# Altium schematic sheet Sheet1.SchDoc
size A; SheetNumber: 1; SheetTotal: 1
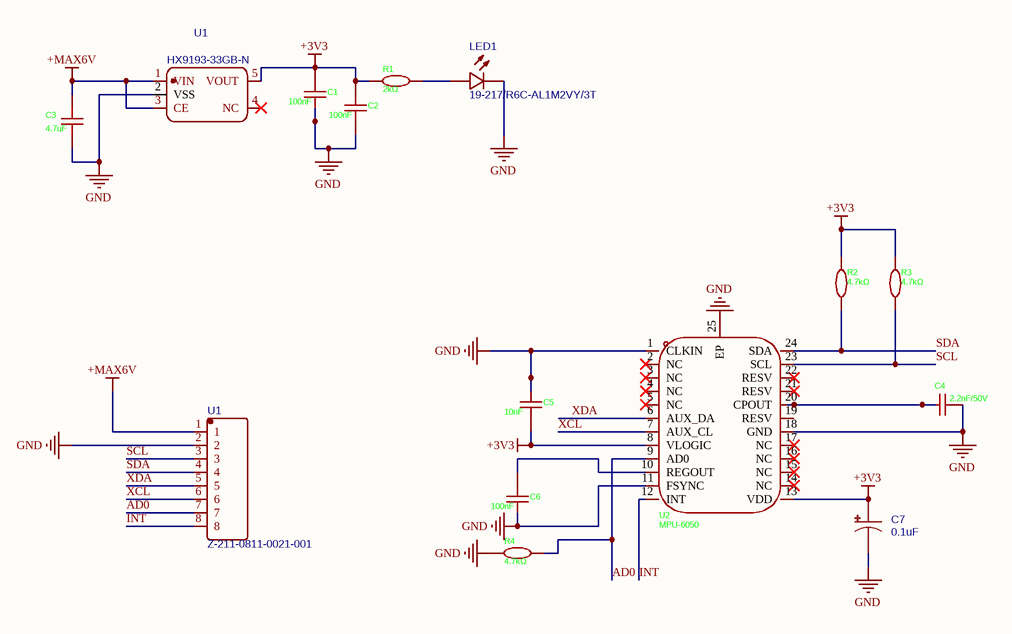
[diagram p0: Sheet1.SchDoc]

## Parts
(Parts that share a designator on the sheet are numbered #1, #2 ... from top to bottom, then left to right.)
C1  100nF  [C0603]
C2  100nF  [C0603]
C3  4.7uF  [C0603]
C4  value 2.2nF/50V  [C0805]
C5  10nF  [C0603]
C6  100nF  [C0603]
C7  0.1uF  [CAP-SMD_L3.2-W1.6]
LED1  19-217/R6C-AL1M2VY/3T  [LED0603-RD]
R1  2kΩ  [R0603]
R2  4.7kΩ  [R0603]
R3  4.7kΩ  [R0603]
R4  4.7kΩ  [R0603]
U1#1  HX9193-33GB-N  [SOT-23-5_L2.9-W1.6-P0.95-LS2.8-BL]
U1#2  Z-211-0811-0021-001  [HDR-TH_8P-P2.54-V-M]
U2  MPU-6050  [QFN-24_L4.0-W4.0-P0.50-BL-EP2.7]

## Nets
+3V3: C1.2 C2.2 C5.1 C7.1 R1.1 R2.2 R3.2 U1#1.5(VOUT) U2.8(VLOGIC) U2.13(VDD)
+MAX6V: C3.2 U1#1.1(VIN) U1#1.3(CE) U1#2.1
GND: C1.1 C2.1 C3.1 C4.2 C5.2 C6.1 C7.2 LED1.1(C) R4.2 U1#1.2(VSS) U1#2.2 U2.1(CLKIN) U2.11(FSYNC) U2.18(GND) U2.25(EP)
AD0: R4.1 U1#2.7 U2.9(AD0)
INT: U1#2.8 U2.12(INT)
SCL: R3.1 U1#2.3 U2.23(SCL)
SDA: R2.1 U1#2.4 U2.24(SDA)
XCL: U1#2.6 U2.7(AUX_CL)
XDA: U1#2.5 U2.6(AUX_DA)
NetC4_1: C4.1 U2.20(CPOUT)
NetC6_2: C6.2 U2.10(REGOUT)
NetLED1_2: LED1.2(A) R1.2

Not connected (* = marked no-connect by the designer): U1#1 4(NC)*; U2 2(NC)* 3(NC)* 4(NC)* 5(NC)* 14(NC)* 15(NC)* 16(NC)* 17(NC)* 19(RESV) 21(RESV)* 22(RESV)*

## Library data of the parts
C1 C2 C6 = CC0603KRX7R9BB104: Manufacturer: YAGEO(国巨); Add into BOM: yes; Tolerance: ±10%; Symbol: CC0603KRX7R9BB104; Device: CC0603KRX7R9BB104; LCSC Part Name: 100nF ±10% 50V; Supplier Part: C14663; Manufacturer Part: CC0603KRX7R9BB104; Supplier Footprint: 0603; JLCPCB Part Class: Basic Part; Datasheet: https://atta.szlcsc.com/upload/public/pdf/source/20180910/C282072_33301C7F631E79921B82A8DAC6BCC5B3.pdf; Supplier: LCSC; Convert to PCB: yes; Value: 100nF
C3 = CL10A475KO8NNNC: Manufacturer: SAMSUNG(三星); Add into BOM: yes; Tolerance: ±10%; Symbol: CL10A475KO8NNNC; Device: CL10A475KO8NNNC; LCSC Part Name: 4.7uF ±10% 16V; Supplier Part: C19666; Manufacturer Part: CL10A475KO8NNNC; Supplier Footprint: 0603; JLCPCB Part Class: Basic Part; Datasheet: https://atta.szlcsc.com/upload/public/pdf/source/20160218/1457707763339.pdf; Supplier: LCSC; Convert to PCB: yes; Value: 4.7uF
C4 = CL21C222JBFNNNE: Manufacturer: SAMSUNG(三星); Add into BOM: yes; Tolerance: ±5%; Symbol: CL21C222JBFNNNE; Device: CL21C222JBFNNNE; LCSC Part Name: 2.2nF ±5% 50V; Supplier Part: C28260; Manufacturer Part: CL21C222JBFNNNE; Supplier Footprint: 0805; JLCPCB Part Class: Basic Part; Datasheet: https://atta.szlcsc.com/upload/public/pdf/source/20160218/1457707763339.pdf; Supplier: LCSC; Convert to PCB: yes
C5 = CC0603KRX7R9BB104: Manufacturer: YAGEO(国巨); Add into BOM: yes; Value: 100nF; Tolerance: ±10%; Symbol: CC0603KRX7R9BB104; Device: CC0603KRX7R9BB104; LCSC Part Name: 100nF ±10% 50V; Supplier Part: C14663; Manufacturer Part: CC0603KRX7R9BB104; Supplier Footprint: 0603; JLCPCB Part Class: Basic Part; Datasheet: https://atta.szlcsc.com/upload/public/pdf/source/20180910/C282072_33301C7F631E79921B82A8DAC6BCC5B3.pdf; Supplier: LCSC; Convert to PCB: yes
C7 = 10uF: Manufacturer: Kyocera AVX; Manufacturer Part: TPSA106K016R1000; nameAlias: Value; Contributor: LCSC; Supplier: LCSC; Supplier Part: C282116; JLCPCB Part Class: Extended Part; spicePre: C; spiceSymbolName: TPSA106K016R1000_C282116
LED1 = 19-217/R6C-AL1M2VY/3T: Manufacturer: EVERLIGHT(亿光); Supplier: LCSC; Manufacturer Part: 19-217/R6C-AL1M2VY/3T; Supplier Part: C72044; JLCPCB Part Class: Extended Part; spicePre: L; spiceSymbolName: 19-217/R6C-AL1M2VY/3T
R1 = RC0603FR-072KL: Manufacturer: YAGEO(国巨); Add into BOM: yes; Tolerance: ±1%; Power(Watts): 100mW; Voltage-Supply(Max): 75V; Temperature Coefficient: ±100ppm/℃; Symbol: RC0603FR-072KL; Device: RC0603FR-072KL; LCSC Part Name: 厚膜电阻 2kΩ ±1% 100mW; Supplier Part: C105576; Manufacturer Part: RC0603FR-072KL; Supplier Footprint: 0603; JLCPCB Part Class: Extended Part; Datasheet: https://atta.szlcsc.com/upload/public/pdf/source/20180316/70C0E2BDAE7FCC62C531A5A58D202EE1.pdf; Supplier: LCSC; Convert to PCB: yes; Type: Thick Film Resistors; Value: 2kΩ; Operating Temperature: -55℃~+155℃
R2-R4 = RC0603FR-074K7L: Manufacturer: YAGEO(国巨); Add into BOM: yes; Tolerance: ±1%; Temperature Coefficient: ±100ppm/℃; Symbol: RC0603FR-074K7L; Device: RC0603FR-074K7L; LCSC Part Name: 厚膜电阻 4.7kΩ ±1% 100mW; Supplier Part: C99782; Manufacturer Part: RC0603FR-074K7L; Supplier Footprint: 0603; JLCPCB Part Class: Extended Part; Datasheet: https://atta.szlcsc.com/upload/public/pdf/source/20180224/C181757_15194369480721363983.pdf; Supplier: LCSC; Convert to PCB: yes; Type: Thick Film Resistors; Value: 4.7kΩ; Operating Temperature Range: -55℃~+155℃
U1#1 = HX9193-33GB-N: Manufacturer: HX(恒佳兴); Contributor: lcsc; Supplier: LCSC; Supplier Part: C2995655; Manufacturer Part: HX9193-33GB-N; JLCPCB Part Class: Extended Part; spicePre: U; spiceSymbolName: HX9193-33GB-N
U1#2 = Z-211-0811-0021-001: Manufacturer: Nextron(正凌); Contributor: LCSC; Supplier: LCSC; Supplier Part: C190820; Manufacturer Part: Z-211-0811-0021-001; JLCPCB Part Class: Extended Part; spicePre: U; spiceSymbolName: Z-211-0811-0021-001
U2 = MPU-6050: Manufacturer: TDK InvenSense(应美盛); Symbol: MPU-6050_C24112; Add into BOM: yes; Sensor Type: 加速度计陀螺仪; Device: MPU-6050; LCSC Part Name: MPU-6050; Supplier Part: C24112; Manufacturer Part: MPU-6050; Supplier Footprint: QFN-24-EP(4x4); JLCPCB Part Class: Extended Part; Datasheet: https://atta.szlcsc.com/upload/public/pdf/source/20140425/1457707046159.pdf; Supplier: LCSC; Convert to PCB: yes; Operating Temperature: -40℃~+85℃